# EAGLE design ACIN (EAGLE 8.2.1)
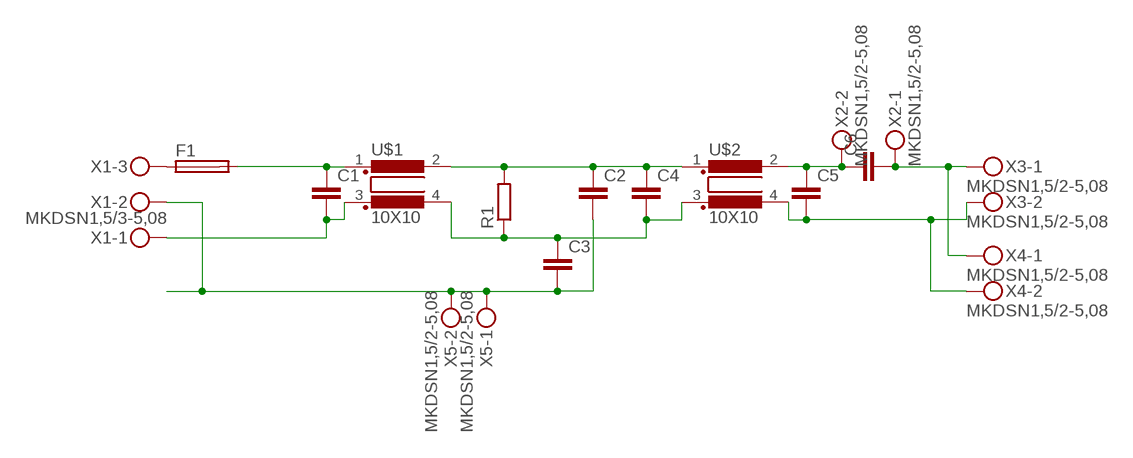
[diagram p0: schematic, sheet 1]

## Parts
C1  C-EU225-087X268  [C225-087X268]
C2  C-EU102-054X133  [C102-054X133]
C3  C-EU102-054X133  [C102-054X133]
C4  C-EU225-087X268  [C225-087X268]
C5  C-EU225-087X268  [C225-087X268]
C6  C-EU075-042X103  [C075-042X103]
F1  SH22,5A  [SH22,5A]
R1  R-EU_0309/12  [0309/12]
U$1  10X10  [10X10]
U$2  10X10  [10X10]
X1  MKDSN1,5/3-5,08  [MKDSN1,5/3-5,08]
X2  MKDSN1,5/2-5,08  [MKDSN1,5/2-5,08]
X3  MKDSN1,5/2-5,08  [MKDSN1,5/2-5,08]
X4  MKDSN1,5/2-5,08  [MKDSN1,5/2-5,08]
X5  MKDSN1,5/2-5,08  [MKDSN1,5/2-5,08]

## Nets
N$1: F1.1 X1.3
N$2: C1.1 F1.2 U$1.1
N$3: C5.1 C6.1 U$2.2 X2.2
N$4: C2.1 C4.1 R1.2 U$1.2 U$2.1
N$5: C3.1 C4.2 R1.1 U$1.4 U$2.3
N$6: C2.2 C3.2 X1.2 X5.1 X5.2
N$7: C6.2 X2.1 X3.1 X4.1
N$8: C5.2 U$2.4 X3.2 X4.2
N$9: C1.2 U$1.3 X1.1

## Library data of the parts
C1-C6 = Vwvwbg:C-EU: CAPACITOR, European symbol
F1 = fuse:SH22,5A: FUSE HOLDER grid 22,5mm, isolated cap OGN0031 8201, Schurter (Buerklin); MPN: 0031.7701.11; OC_FARNELL: unknown; OC_NEWARK: 04F1224
R1 = Vwvwbg:R-EU_: RESISTOR, European symbol
U$1 U$2 = inductors:10X10
X1 = con-phoenix-508:MKDSN1,5/3-5,08: MKDSN 1,5/ 3-5,08 Printklemme Nennstrom: 13,5 A Nennspannung: 250 V Rastermaß: 5,08 mm Polzahl: 3 Anschlussart: Schraubanschluss Montage: Löten Anschlussrichtung Leiter/Platine: 0 ° Artikelnummer: 1729131 Source: http://eshop.phoenixcontact.com .. 1729131.pdf
X2-X5 = con-phoenix-508:MKDSN1,5/2-5,08: MKDSN 1,5/ 2-5,08 Printklemme Nennstrom: 13,5 A Nennspannung: 250 V Rastermaß: 5,08 mm Polzahl: 2 Anschlussart: Schraubanschluss Montage: Löten Anschlussrichtung Leiter/Platine: 0 ° Artikelnummer: 1729128 Source: http://eshop.phoenixcontact.com .. 1729128.pdf

## Board
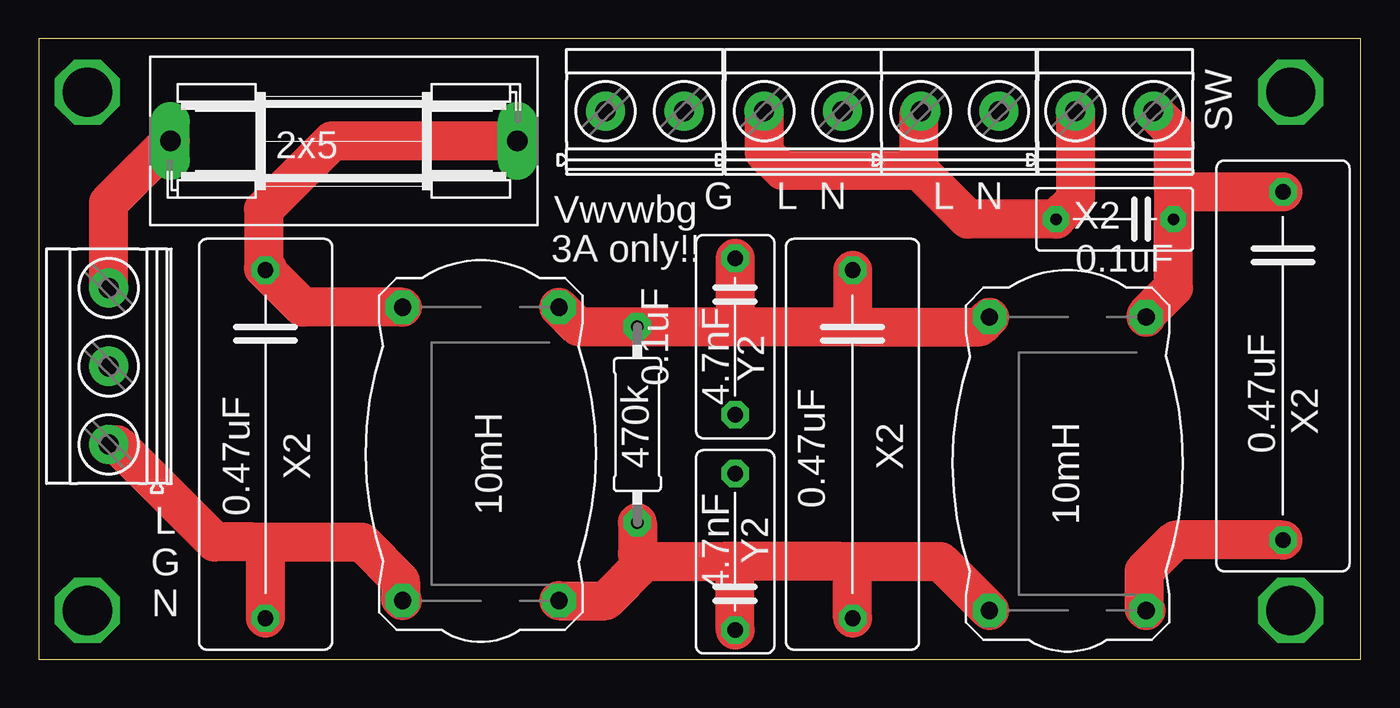
[diagram p1: board, top side]
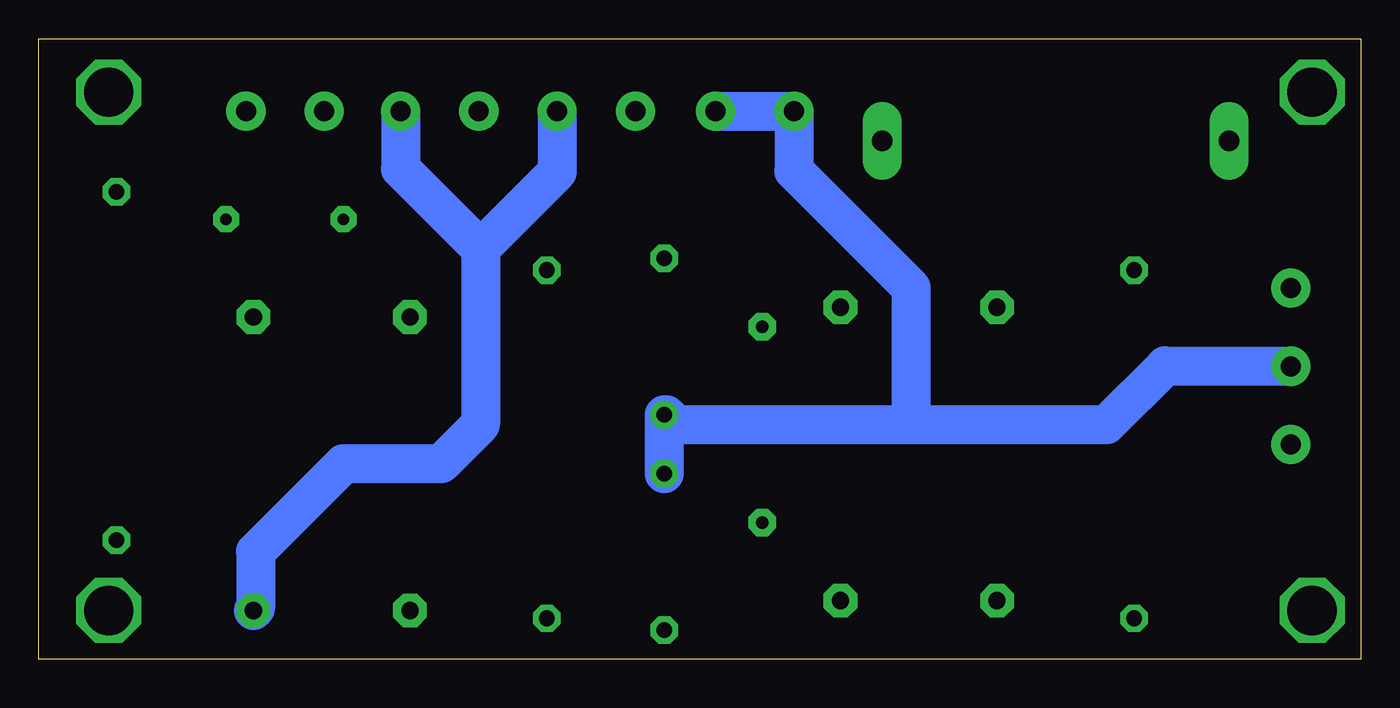
[diagram p2: board, bottom side, seen from below]

Size 85.83 x 40.31 mm. Coordinates in mm from the lower left corner, seen from the top.
Outline: 0,0 85.83,0 85.83,40.31 0,40.31 0,0
Copper layers (1*16): Top 0.035mm / dielectric 1.5mm / Bottom 0.035mm
Design rules "default": minimum track width 6mil, minimum drill 0.3mm, track to track 7mil, track to pad 7mil, pad to pad 7mil, via to via 7mil, smd to smd 7mil, copper to edge 8mil, drill to drill 8mil, minimum pad ring 6mil, minimum via ring 6mil, stop-mask expansion 4mil, vias tented up to drill 0mil, thermal gap 10mil

### Footprints (pad centres in the part's own frame; a part is rotated, then mirrored left to right if it is on the bottom)
C225-087X268 = drill 1.016 pad 1.778 octagon: 1 -11.303,0; 2 11.303,0
C102-054X133 = drill 1.016 pad 1.778 octagon: 1 -5.08,0; 2 5.08,0
C075-042X103 = drill 0.75 pad 1.676 octagon: 1 -3.81,0; 2 3.81,0
SH22,5A = drill 1.321 pad 2.54 long: 1 -11.252,0; 2 11.252,0
0309/12 = drill 0.813 pad 1.778 octagon: 1 -6.35,0; 2 6.35,0
10X10 = drill 1.118 pad 2.184 octagon: 1 -10.16,-7.62; 2 -10.16,2.54; 3 8.89,-7.62; 4 8.89,2.54
MKDSN1,5/3-5,08 = drill 1.3 pad 2.54: 1 -7.641,0.025; 2 -2.561,0.025; 3 2.519,0.025
MKDSN1,5/2-5,08 = drill 1.3 pad 2.54: 1 -2.561,0.025; 2 2.519,0.025

### Placement (x,y rotation side)
C1  14.73,13.97 270 top
C2  45.21,20.95 270 top
C3  45.21,6.99 90 top
C4  52.83,13.97 270 top
C5  80.77,19.05 270 top
C6  69.85,28.57 180 top
F1  19.81,33.66 0 top
R1  38.86,15.24 90 top
U$1  31.24,12.7 270 top
U$2  69.34,12.06 270 top
X1  4.57,21.59 90 top
X2  69.85,35.56 0 top
X3  49.66,35.56 0 top
X4  59.82,35.56 0 top
X5  39.37,35.56 0 top

### Tracks (layer width: path | path; a pad name or v marks a point on that pad's centre or on a via)
N$1
  Top 2.54: X1.3 4.55,29.64 F1.1
N$2
  Top 2.54: F1.2 19.05,33.66 14.61,29.21 14.61,25.4 C1.1 | 14.86,25.4 C1.1 | U$1.1 17.14,22.86 C1.1
N$3
  Top 2.54: U$2.2 71.88,22.35 73.66,24.13 C6.1 73.66,30.48 | 73.66,30.48 73.66,34.29 72.39,35.56 X2.2 | C5.1 73.79,30.35 73.66,30.48
N$4
  Top 2.54: 44.45,21.59 R1.2 35.05,21.59 U$1.2 | 53.34,21.59 44.45,21.59 | 53.34,21.59 61.09,21.59 U$2.1 | C2.1 45.21,22.35 44.45,21.59 | C4.1 52.83,22.1 53.34,21.59
N$5
  Top 2.54: 39.37,6.35 44.45,6.35 | 52.07,6.35 44.45,6.35 | 52.07,6.35 58.55,6.35 U$2.3 | R1.1 38.86,6.86 39.37,6.35 | C3.1 45.21,5.59 44.45,6.35 | C4.2 52.83,5.59 52.07,6.35 | U$1.4 36.83,3.81 39.37,6.35
N$6
  Bottom 2.54: C3.2 C2.2 45.09,15.88 44.45,15.24 29.21,15.24 | X5.2 X5.1 36.81,31.73 29.21,24.13 29.21,15.24 | 29.21,15.24 16.51,15.24 12.7,19.05 4.57,19.05 X1.2
N$7
  Top 2.54: X2.1 67.29,29.82 C6.2 60.33,28.57 57.15,31.75 | 57.15,31.75 57.15,35.48 X4.1 | X3.1 47.1,32.91 48.26,31.75 57.15,31.75
N$8
  Top 2.54: C5.2 73.79,7.75 71.75,5.71 71.75,3.3 U$2.4
  Bottom 2.54: X3.2 52.18,31.64 57.15,26.67 | 57.15,26.67 57.15,15.24 59.69,12.7 66.04,12.7 71.75,6.99 71.75,3.3 U$2.4 | X4.2 62.34,31.86 57.15,26.67
N$9
  Top 2.54: X1.1 5.1,13.95 11.43,7.62 13.97,7.62 | 13.97,7.62 20.95,7.62 23.5,5.08 23.5,3.94 U$1.3 | C1.2 14.73,6.86 13.97,7.62
N$15  (via drill 3.2 pad 2.3)
  other vias: 3.17,36.83
N$16  (via drill 3.2 pad 2.3)
  other vias: 3.17,3.17
N$17  (via drill 3.2 pad 2.3)
  other vias: 81.28,3.17
N$18  (via drill 3.2 pad 2.3)
  other vias: 81.28,36.83

### Text on the board
tPlace: SW | 2x5 | L N | L N | Vwvwbg | G | X2 | 3A only!! | 0.1uF | 0.1uF | 4.7nF | Y2 | 0.47uF | X2 | 470k | 0.47uF | X2 | 0.47uF | X2 | 10mH | 10mH | 4.7nF | Y2 | L / G / N